# EAGLE design opto4 (EAGLE 6.6.0)
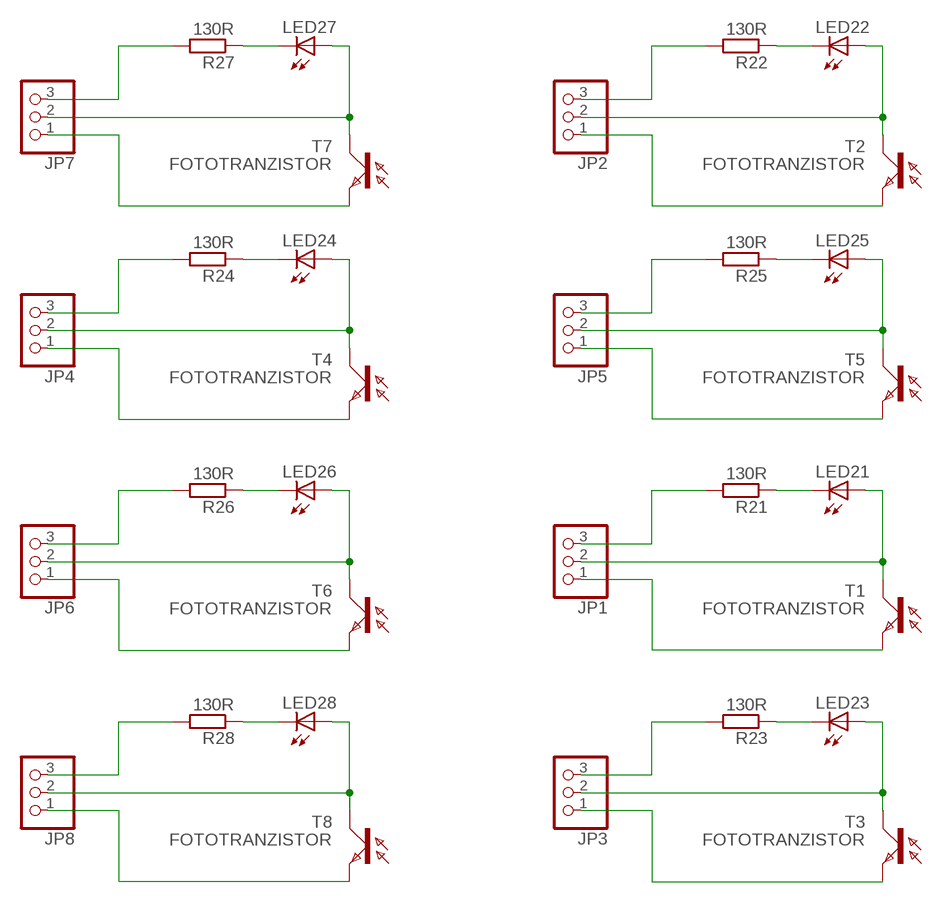
[diagram p0: schematic, sheet 1]

## Parts
JP1  PINHD-1X3/90  [1X03/90]
JP2  PINHD-1X3/90  [1X03/90]
JP3  PINHD-1X3/90  [1X03/90]
JP4  PINHD-1X3/90  [1X03/90]
JP5  PINHD-1X3/90  [1X03/90]
JP6  PINHD-1X3/90  [1X03/90]
JP7  PINHD-1X3/90  [1X03/90]
JP8  PINHD-1X3/90  [1X03/90]
LED21  LED3MM  [LED3MM]
LED22  LED3MM  [LED3MM]
LED23  LED3MM  [LED3MM]
LED24  LED3MM  [LED3MM]
LED25  LED3MM  [LED3MM]
LED26  LED3MM  [LED3MM]
LED27  LED3MM  [LED3MM]
LED28  LED3MM  [LED3MM]
R21  130R  R-EU_R1206  [R1206]
R22  130R  R-EU_R1206  [R1206]
R23  130R  R-EU_R1206  [R1206]
R24  130R  R-EU_R1206  [R1206]
R25  130R  R-EU_R1206  [R1206]
R26  130R  R-EU_R1206  [R1206]
R27  130R  R-EU_R1206  [R1206]
R28  130R  R-EU_R1206  [R1206]
T1  FOTOTRANZISTOR  [BPX81]
T2  FOTOTRANZISTOR  [BPX81]
T3  FOTOTRANZISTOR  [BPX81]
T4  FOTOTRANZISTOR  [BPX81]
T5  FOTOTRANZISTOR  [BPX81]
T6  FOTOTRANZISTOR  [BPX81]
T7  FOTOTRANZISTOR  [BPX81]
T8  FOTOTRANZISTOR  [BPX81]

## Nets
N$1: LED25.K(C) R25.1
N$3: JP1.3 R21.2
N$4: JP1.2 LED21.A T1.C
N$5: JP1.1 T1.E
N$6: LED21.K(C) R21.1
N$7: JP2.3 R22.2
N$8: JP2.2 LED22.A T2.C
N$9: JP2.1 T2.E
N$10: LED22.K(C) R22.1
N$11: JP3.3 R23.2
N$12: JP3.2 LED23.A T3.C
N$13: JP3.1 T3.E
N$14: LED23.K(C) R23.1
N$15: JP4.3 R24.2
N$16: JP4.2 LED24.A T4.C
N$17: JP5.3 R25.2
N$18: JP4.1 T4.E
N$19: JP5.2 LED25.A T5.C
N$20: JP5.1 T5.E
N$21: LED24.K(C) R24.1
N$22: JP6.3 R26.2
N$23: JP6.2 LED26.A T6.C
N$24: JP6.1 T6.E
N$25: LED26.K(C) R26.1
N$26: JP7.3 R27.2
N$27: JP7.2 LED27.A T7.C
N$28: JP7.1 T7.E
N$29: LED27.K(C) R27.1
N$30: JP8.3 R28.2
N$31: JP8.2 LED28.A T8.C
N$32: JP8.1 T8.E
N$33: LED28.K(C) R28.1

## Library data of the parts
JP1-JP8 = pinhead:PINHD-1X3: PIN HEADER
LED21-LED28 = led:LED: LED OSRAM: - CHIPLED LG R971, LG N971, LY N971, LG Q971, LY Q971, LO R971, LY R971 LH N974, LH R974 LS Q976, LO Q976, LY Q976 LO Q996 - Hyper CHIPLED LW Q18S LB Q993, LB Q99A, LB R99A - SideLED LS A670, LO A670, LY A670, LG A670, LP A670 LB A673, LV A673, LT A673, LW A673 LH A674 LY A675 LS A676, LA A676, LO A676, LY A676, LW A676 LS A679, LY A679, LG A679 - Hyper Micro SIDELED® LS Y876, LA Y876, LO Y876, LY Y876 LT Y87S - SmartLED LW L88C, LW L88S LB L89C, LB L89S, LG L890 LS L89K, LO L89K, LY L89K LS L896, LA L896, LO L896, LY L896 - TOPLED LS T670, LO T670, LY T670, LG T670, LP T670 LSG T670, LSP T670, LSY T670, LOP T670, LYG T670 LG T671, LOG T671, LSG T671 LB T673, LV T673, LT T673, LW T673 LH T674 LS T676, LA T676, LO T676, LY T676, LB T676, LH T676, LSB T676, LW T676 LB T67C, LV T67C, LT T67C, LS T67K, LO T67K, LY T67K, LW E67C LS E67B, LA E67B, LO E67B, LY E67B, LB E67C, LV E67C, LT E67C LW T67C LS T679, LY T679, LG T679 LS T770, LO T770, LY T770, LG T770, LP T770 LB T773, LV T773, LT T773, LW T773 LH T774 LS E675, LA E675, LY E675, LS T675 LS T776, LA T776, LO T776, LY T776, LB T776 LHGB T686 LT T68C, LB T68C - Hyper Mini TOPLED® LB M676 - Mini TOPLED Santana® LG M470 LS M47K, LO M47K, LY M47K Source: http://www.osram.convergy.de LUXEON: - LUMILED® LXK2-PW12-R00, LXK2-PW12-S00, LXK2-PW14-U00, LXK2-PW14-V00 LXK2-PM12-R00, LXK2-PM12-S00, LXK2-PM14-U00 LXK2-PE12-Q00, LXK2-PE12-R00, LXK2-PE12-S00, LXK2-PE14-T00, LXK2-PE14-U00 LXK2-PB12-K00, LXK2-PB12-L00, LXK2-PB12-M00, LXK2-PB14-N00, LXK2-PB14-P00, LXK2-PB14-Q00 LXK2-PR12-L00, LXK2-PR12-M00, LXK2-PR14-Q00, LXK2-PR14-R00 LXK2-PD12-Q00, LXK2-PD12-R00, LXK2-PD12-S00 LXK2-PH12-R00, LXK2-PH12-S00 LXK2-PL12-P00, LXK2-PL12-Q00, LXK2-PL12-R00 Source: www.luxeon.com KINGBRIGHT: KA-3528ASYC Source: www.kingbright.com
R21-R28 = resistor:R-EU_: RESISTOR, European symbol
T1-T8 = custom:FOTOTRANZISTOR: PHOTO TRANSISTOR; OC_FARNELL: unknown; OC_NEWARK: unknown

## Board
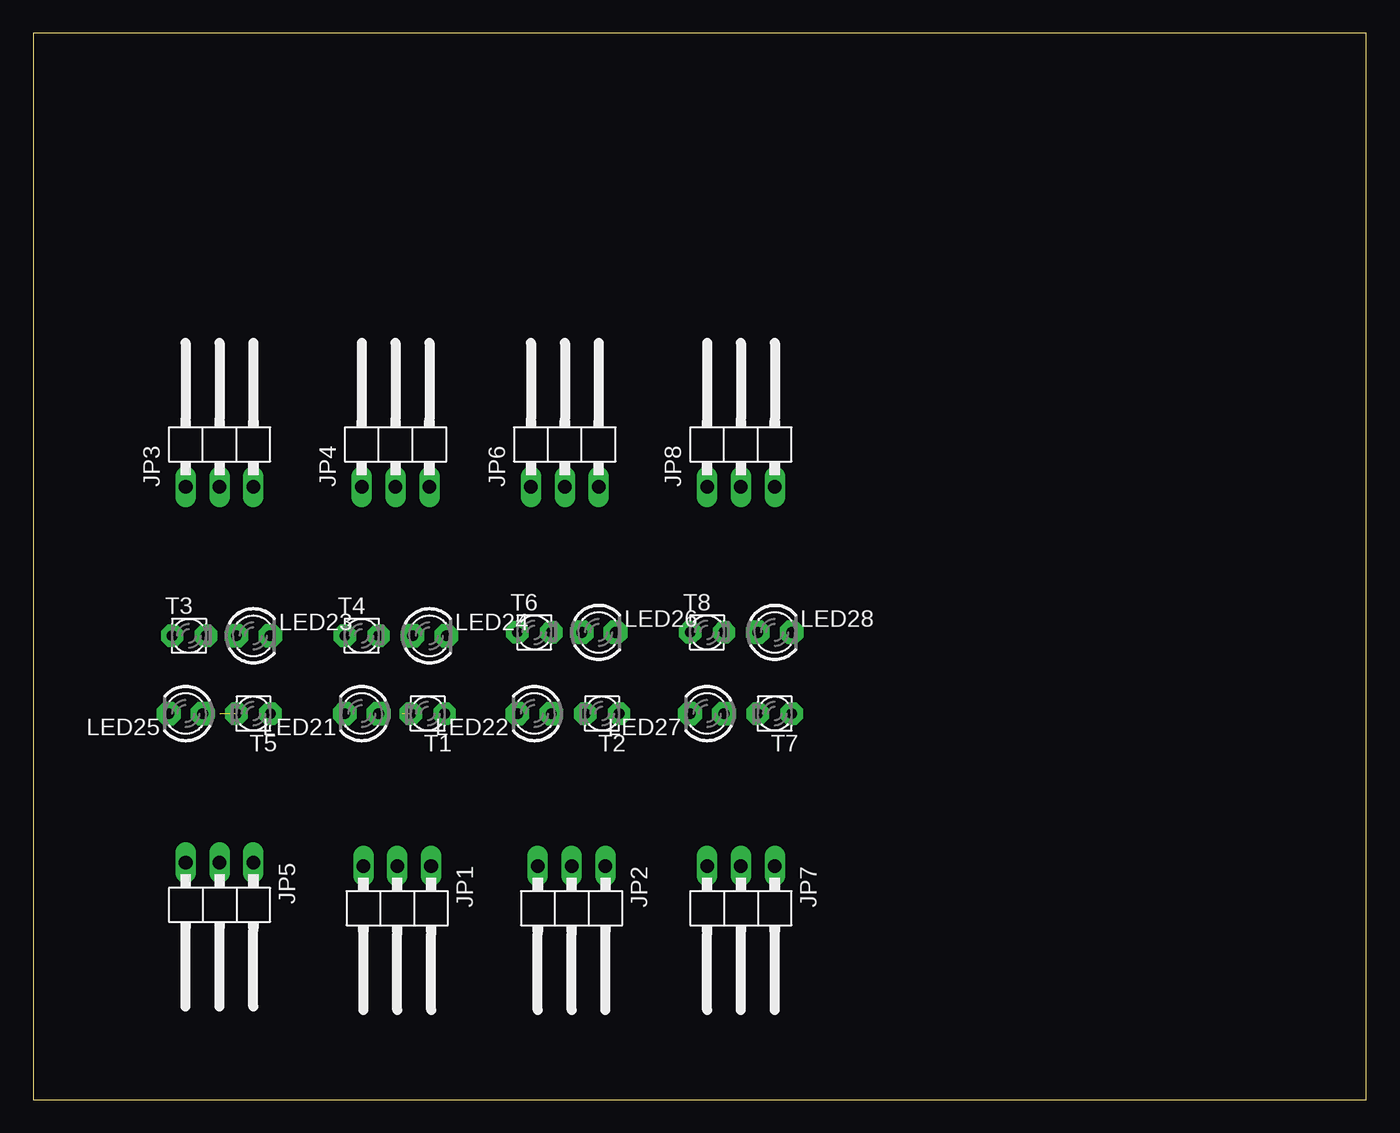
[diagram p1: board, top side]
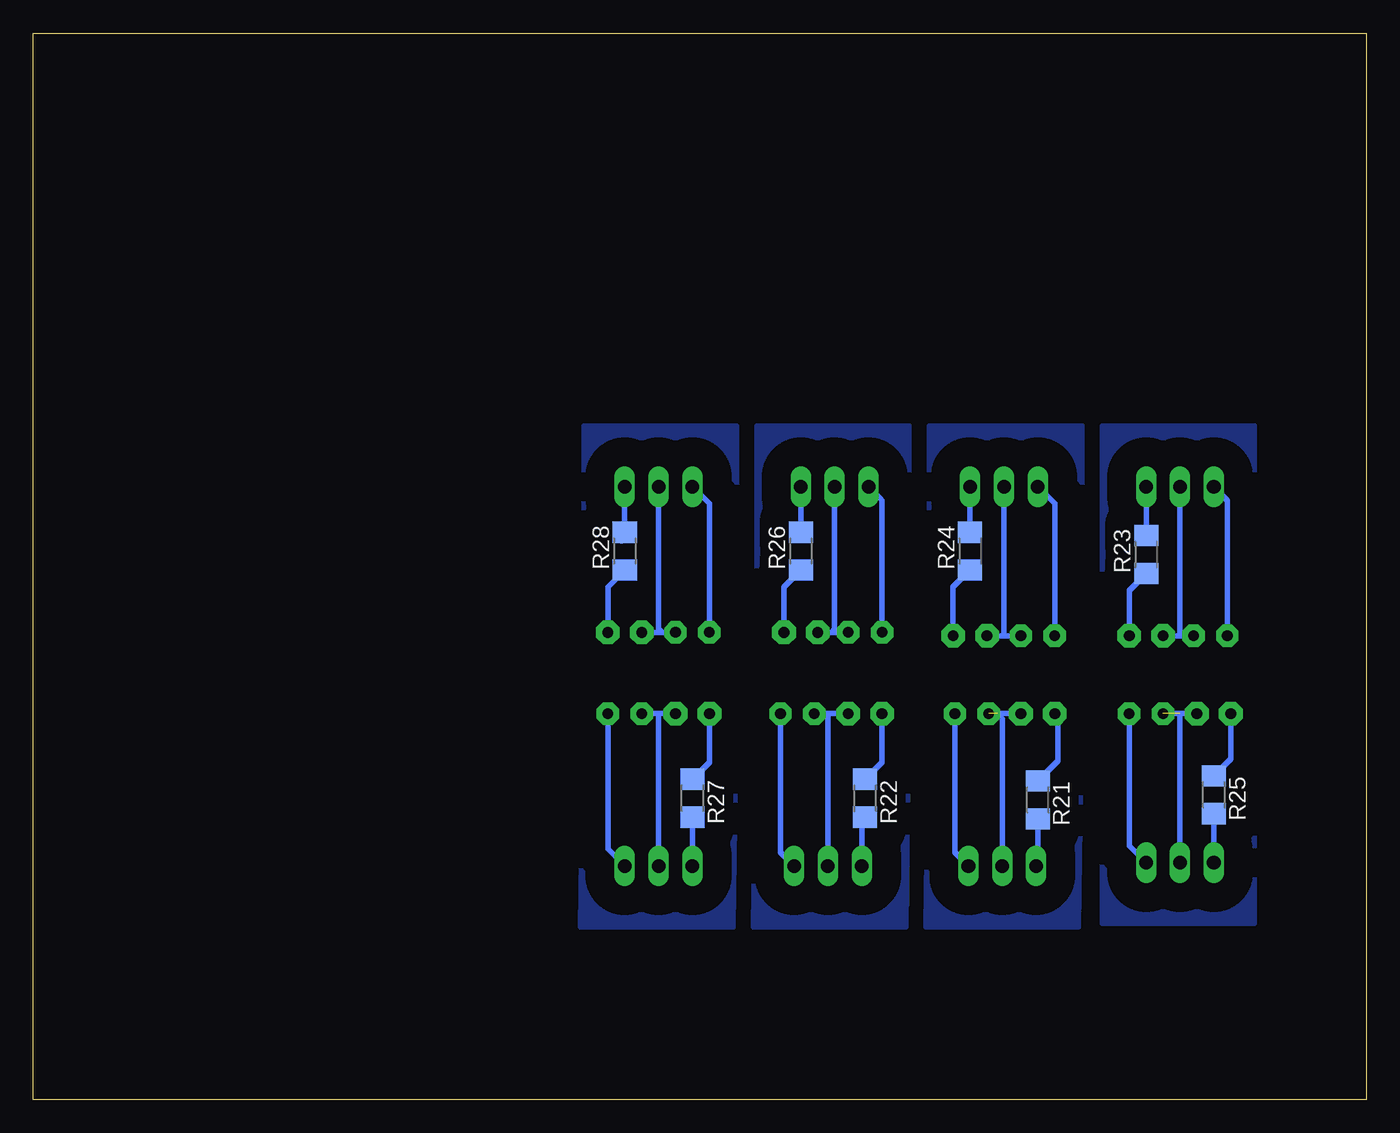
[diagram p2: board, bottom side, seen from below]

Size 100 x 80 mm. Coordinates in mm from the lower left corner, seen from the top.
Outline: 0,0 100,0 100,80 0,80 0,0
Copper layers (1*16): Top 0.035mm / dielectric 1.5mm / Bottom 0.035mm
Design rules "default": minimum track width 10mil, minimum drill 24mil, track to track 8mil, track to pad 8mil, pad to pad 8mil, via to via 8mil, smd to smd 8mil, copper to edge 40mil, drill to drill 8mil, minimum pad ring 10mil, minimum via ring 8mil, stop-mask expansion 4mil, vias tented up to drill 0mil, thermal gap 10mil

### Footprints (pad centres in the part's own frame; a part is rotated, then mirrored left to right if it is on the bottom)
1X03/90 = drill 1.016 long: 1 -2.54,-3.81; 2 0,-3.81; 3 2.54,-3.81
LED3MM = drill 0.813 pad 1.778 octagon: A -1.27,0; K 1.27,0
R1206 = smd 1.6 x 1.803: 1 -1.422,0; 2 1.422,0
BPX81 = drill 0.8 pad 1.676 octagon: C 1.27,0; E -1.27,0

### Placement (x,y rotation side)
JP1  27.3,13.72 180 top
JP2  40.39,13.72 180 top
JP3  13.97,49.78 0 top
JP4  27.18,49.78 0 top
JP5  13.97,13.97 180 top
JP6  39.88,49.78 0 top
JP7  53.09,13.72 180 top
JP8  53.09,49.78 0 top
LED21  24.64,28.96 180 top
LED22  37.59,28.96 180 top
LED23  16.51,34.8 0 top
LED24  29.72,34.8 0 top
LED25  11.43,28.96 180 top
LED26  42.42,35.05 0 top
LED27  50.55,28.96 180 top
LED28  55.63,35.05 0 top
R21  24.64,22.48 270 bottom
R22  37.59,22.61 270 bottom
R23  16.51,40.89 90 bottom
R24  29.72,41.15 90 bottom
R25  11.43,22.86 270 bottom
R26  42.42,41.15 90 bottom
R27  50.55,22.61 270 bottom
R28  55.63,41.15 90 bottom
T1  29.59,28.96 180 top
T2  42.67,28.96 180 top
T3  11.68,34.8 0 top
T4  24.64,34.8 0 top
T5  16.51,28.96 180 top
T6  37.59,35.05 0 top
T7  55.63,28.96 180 top
T8  50.55,35.05 0 top

### Tracks (layer width: path | path; a pad name or v marks a point on that pad's centre or on a via)
N$1
  Bottom 0.406: LED25.K 10.16,25.55 R25.1
N$2
  pour Bottom (isolate 2.184): 8.38,30.99 8.38,13.21 19.81,13.21 19.81,30.99
  pour Bottom (isolate 2.184): 21.34,30.99 21.59,12.95 33.02,12.95 32.77,30.99
  pour Bottom (isolate 2.184): 34.29,30.99 34.54,12.95 45.97,12.95 45.72,30.99
  pour Bottom (isolate 2.184): 47.24,30.99 47.5,12.95 58.93,12.95 58.67,30.99
  pour Bottom (isolate 2.184): 8.38,50.55 8.38,32.77 19.81,32.77 19.81,50.55
  pour Bottom (isolate 2.184): 21.34,50.55 21.34,32.77 32.77,32.77 32.77,50.55
  pour Bottom (isolate 2.184): 34.29,50.55 34.29,32.77 45.72,32.77 45.72,50.55
  pour Bottom (isolate 2.184): 47.24,50.55 47.24,32.77 58.67,32.77 58.67,50.55
N$3
  Bottom 0.406: JP1.3 24.64,17.53 R21.2
N$4  (1 unrouted)
  Bottom 0.406: JP1.2 27.3,28.57 27.69,28.96 | LED21.A T1.C
N$5
  Bottom 0.406: JP1.1 30.86,18.54 T1.E
N$6
  Bottom 0.406: R21.1 23.11,25.43 23.11,29.46 23.37,29.21 LED21.K
N$7
  Bottom 0.406: JP2.3 37.85,20.93 R22.2
N$8
  Bottom 0.406: JP2.2 40.39,28.96 | 40.39,28.96 LED22.A | T2.C 40.39,28.96
N$9
  Bottom 0.406: JP2.1 43.94,18.54 T2.E
N$10
  Bottom 0.406: LED22.K 36.32,25.3 R22.1
N$11
  Bottom 0.406: JP3.3 R23.2
N$12
  Bottom 0.406: JP3.2 13.97,34.8 LED23.A T3.C
N$13
  Bottom 0.406: JP3.1 10.41,44.96 T3.E
N$14
  Bottom 0.406: LED23.K 17.78,38.2 R23.1
N$15
  Bottom 0.406: JP4.3 R24.2
N$16
  Bottom 0.406: JP4.2 27.18,34.8 LED24.A T4.C
N$17
  Bottom 0.406: JP5.3 R25.2
N$18
  Bottom 0.406: JP4.1 23.37,44.7 T4.E
N$19  (1 unrouted)
  Bottom 0.406: JP5.2 13.97,28.96 | T5.C LED25.A
N$20
  Bottom 0.406: JP5.1 17.78,19.05 T5.E
N$21
  Bottom 0.406: LED24.K 30.99,38.46 R24.1
N$22
  Bottom 0.406: JP6.3 R26.2
N$23
  Bottom 0.406: JP6.2 39.88,35.31 | 39.88,35.31 39.88,35.05 | LED26.A 40.39,35.05 40.13,35.05 | 40.13,35.05 39.88,35.31 | T6.C 40.13,35.05
N$24
  Bottom 0.406: JP6.1 36.45,45.09 36.32,44.96 T6.E
N$25
  Bottom 0.406: LED26.K 43.69,38.46 R26.1
N$26
  Bottom 0.406: JP7.3 R27.2
N$27
  Bottom 0.406: JP7.2 53.09,28.96 | 53.09,28.96 LED27.A | T7.C 53.09,28.96
N$28
  Bottom 0.406: JP7.1 56.9,18.8 T7.E
N$29
  Bottom 0.406: LED27.K 49.28,25.3 R27.1
N$30
  Bottom 0.406: JP8.3 R28.2 | R28.2 55.63,42.16 55.88,41.91 55.88,42.32 R28.2
N$31
  Bottom 0.406: LED28.A 53.34,35.05 52.83,35.05 | JP8.2 53.09,35.31 52.83,35.05 | T8.C 52.83,35.05
N$32
  Bottom 0.406: JP8.1 49.28,44.7 T8.E
N$33
  Bottom 0.406: LED28.K 56.9,38.46 R28.1